# Altium schematic sheet 09 LEDs(2).SchDoc
size A
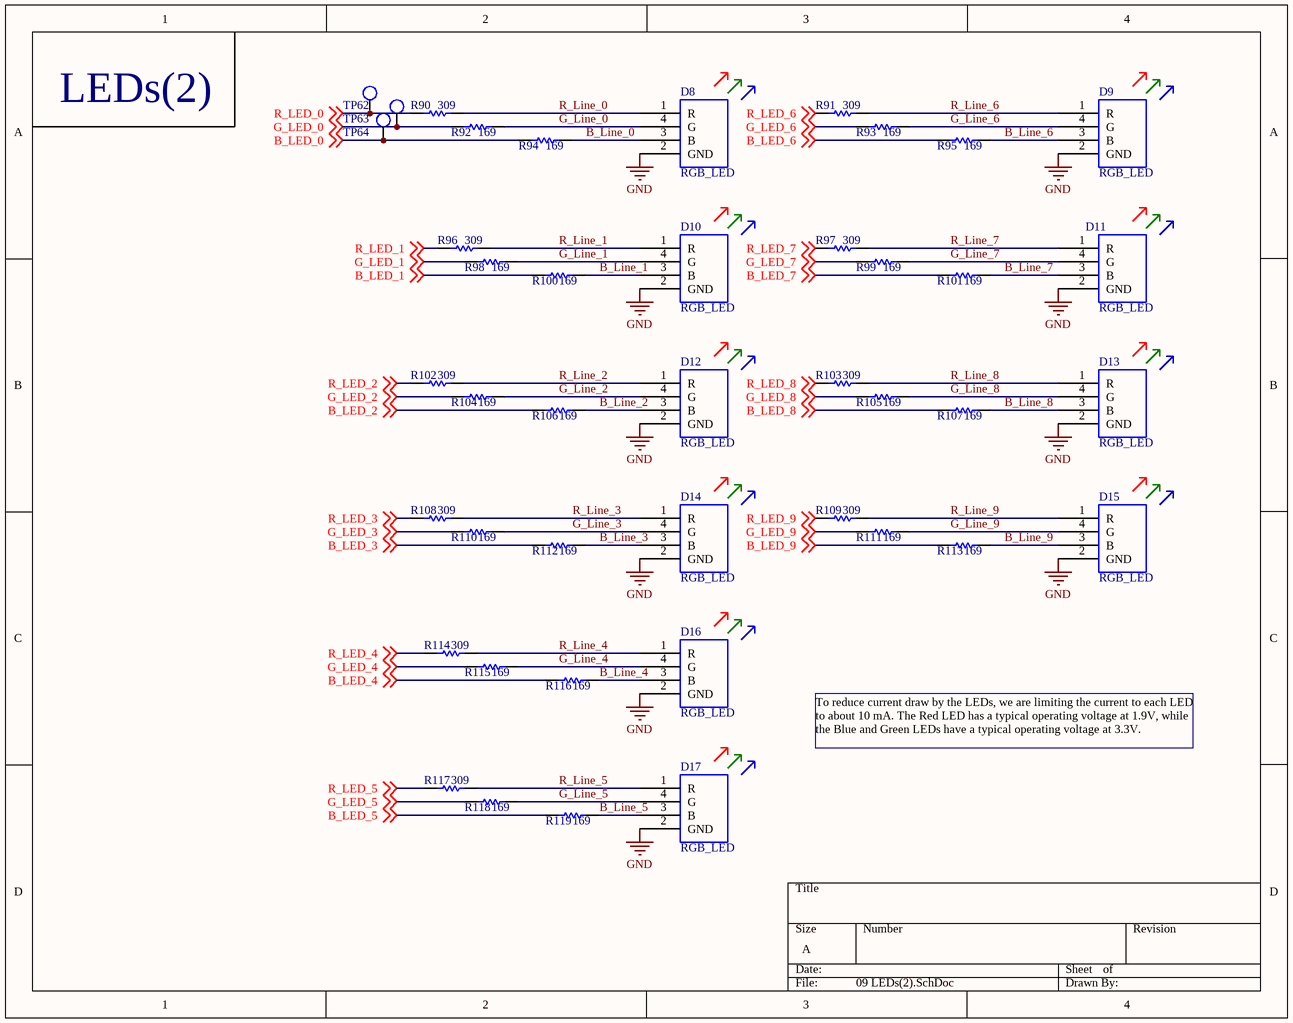
[diagram p0: 09 LEDs(2).SchDoc]

## Parts
D8  RGB_LED  [RGB_LED]
D9  RGB_LED  [RGB_LED]
D10  RGB_LED  [RGB_LED]
D11  RGB_LED  [RGB_LED]
D12  RGB_LED  [RGB_LED]
D13  RGB_LED  [RGB_LED]
D14  RGB_LED  [RGB_LED]
D15  RGB_LED  [RGB_LED]
D16  RGB_LED  [RGB_LED]
D17  RGB_LED  [RGB_LED]
R90  RES_0805_309  [RES0805]  (value not drawn)
R91  RES_0805_309  [RES0805]  (value not drawn)
R92  169 Ohm  [RES0805]  (value not drawn)
R93  169 Ohm  [RES0805]  (value not drawn)
R94  169 Ohm  [RES0805]  (value not drawn)
R95  169 Ohm  [RES0805]  (value not drawn)
R96  RES_0805_309  [RES0805]  (value not drawn)
R97  RES_0805_309  [RES0805]  (value not drawn)
R98  169 Ohm  [RES0805]  (value not drawn)
R99  169 Ohm  [RES0805]  (value not drawn)
R100  169 Ohm  [RES0805]  (value not drawn)
R101  169 Ohm  [RES0805]  (value not drawn)
R102  RES_0805_309  [RES0805]  (value not drawn)
R103  RES_0805_309  [RES0805]  (value not drawn)
R104  169 Ohm  [RES0805]  (value not drawn)
R105  169 Ohm  [RES0805]  (value not drawn)
R106  169 Ohm  [RES0805]  (value not drawn)
R107  169 Ohm  [RES0805]  (value not drawn)
R108  RES_0805_309  [RES0805]  (value not drawn)
R109  RES_0805_309  [RES0805]  (value not drawn)
R110  169 Ohm  [RES0805]  (value not drawn)
R111  169 Ohm  [RES0805]  (value not drawn)
R112  169 Ohm  [RES0805]  (value not drawn)
R113  169 Ohm  [RES0805]  (value not drawn)
R114  RES_0805_309  [RES0805]  (value not drawn)
R115  169 Ohm  [RES0805]  (value not drawn)
R116  169 Ohm  [RES0805]  (value not drawn)
R117  RES_0805_309  [RES0805]  (value not drawn)
R118  169 Ohm  [RES0805]  (value not drawn)
R119  169 Ohm  [RES0805]  (value not drawn)
TP62  TP  [TestPoint_0805]  (value not drawn)
TP63  TP  [TestPoint_0805]  (value not drawn)
TP64  TP  [TestPoint_0805]  (value not drawn)

## Nets
GND: D8.2(GND) D9.2(GND) D10.2(GND) D11.2(GND) D12.2(GND) D13.2(GND) D14.2(GND) D15.2(GND) D16.2(GND) D17.2(GND)
B_LED_0: R94.1 TP64.1 ; off-sheet B_LED_0
B_LED_1: R100.1 ; off-sheet B_LED_1
B_LED_2: R106.1 ; off-sheet B_LED_2
B_LED_3: R112.1 ; off-sheet B_LED_3
B_LED_4: R116.1 ; off-sheet B_LED_4
B_LED_5: R119.1 ; off-sheet B_LED_5
B_LED_6: R95.1 ; off-sheet B_LED_6
B_LED_7: R101.1 ; off-sheet B_LED_7
B_LED_8: R107.1 ; off-sheet B_LED_8
B_LED_9: R113.1 ; off-sheet B_LED_9
B_Line_0: D8.3(B) R94.2
B_Line_1: D10.3(B) R100.2
B_Line_2: D12.3(B) R106.2
B_Line_3: D14.3(B) R112.2
B_Line_4: D16.3(B) R116.2
B_Line_5: D17.3(B) R119.2
B_Line_6: D9.3(B) R95.2
B_Line_7: D11.3(B) R101.2
B_Line_8: D13.3(B) R107.2
B_Line_9: D15.3(B) R113.2
G_LED_0: R92.1 TP63.1 ; off-sheet G_LED_0
G_LED_1: R98.1 ; off-sheet G_LED_1
G_LED_2: R104.1 ; off-sheet G_LED_2
G_LED_3: R110.1 ; off-sheet G_LED_3
G_LED_4: R115.1 ; off-sheet G_LED_4
G_LED_5: R118.1 ; off-sheet G_LED_5
G_LED_6: R93.1 ; off-sheet G_LED_6
G_LED_7: R99.1 ; off-sheet G_LED_7
G_LED_8: R105.1 ; off-sheet G_LED_8
G_LED_9: R111.1 ; off-sheet G_LED_9
G_Line_0: D8.4(G) R92.2
G_Line_1: D10.4(G) R98.2
G_Line_2: D12.4(G) R104.2
G_Line_3: D14.4(G) R110.2
G_Line_4: D16.4(G) R115.2
G_Line_5: D17.4(G) R118.2
G_Line_6: D9.4(G) R93.2
G_Line_7: D11.4(G) R99.2
G_Line_8: D13.4(G) R105.2
G_Line_9: D15.4(G) R111.2
R_LED_0: R90.1 TP62.1 ; off-sheet R_LED_0
R_LED_1: R96.1 ; off-sheet R_LED_1
R_LED_2: R102.1 ; off-sheet R_LED_2
R_LED_3: R108.1 ; off-sheet R_LED_3
R_LED_4: R114.1 ; off-sheet R_LED_4
R_LED_5: R117.1 ; off-sheet R_LED_5
R_LED_6: R91.1 ; off-sheet R_LED_6
R_LED_7: R97.1 ; off-sheet R_LED_7
R_LED_8: R103.1 ; off-sheet R_LED_8
R_LED_9: R109.1 ; off-sheet R_LED_9
R_Line_0: D8.1(R) R90.2
R_Line_1: D10.1(R) R96.2
R_Line_2: D12.1(R) R102.2
R_Line_3: D14.1(R) R108.2
R_Line_4: D16.1(R) R114.2
R_Line_5: D17.1(R) R117.2
R_Line_6: D9.1(R) R91.2
R_Line_7: D11.1(R) R97.2
R_Line_8: D13.1(R) R103.2
R_Line_9: D15.1(R) R109.2

## Notes on the sheet
- LEDs(2)
- To reduce current draw by the LEDs, we are limiting the current to each LED to about 10 mA. The Red LED has a typical operating voltage at 1.9V, while the Blue and Green LEDs have a typical operating voltage at 3.3V.
- (in symbol RES_0805_169) 169
- (in symbol RES_0805_309) 309

## Library data of the parts
D8-D17 = RGB_LED: WP154A4SUREQBFZGC; Manufacturer: Kingbright; Colour: Blue,Green,Red; Luminous Intensity: 900mcd; Lens Style: Dome,Clear; Forward Current: 20mA; Forward Voltage: 3.3V; Viewing Angle: 50°; Dominant Wavelength: 465nm; Supplier 1: Digi-Key; Manufacturer Part Number: WP154A4SUREQBFZGC; Stock 1: 8274; Pricing 1: 1=1.89, 10=1.534, 25=1.18, 100=1.062, 250=0.944, 500=0.8024, 1000=0.6608, 2500=0.6278, 5000=0.6136 (USD); Mount: Through Hole; Case/Package: Radial; Min Operating Temperature: -40°C; Max Operating Temperature: 85°C; Packaging: Bulk; Package Quantity: 500; Test Current: 20mA; Height: 8.6mm; Lead Free: Lead Free; ComponentLink1URL: https://datasheet.ciiva.com/6349/wp154a4sureqbfzgc-6349426.pdf; ComponentLink1Description: https://datasheet.ciiva.com/6349/wp154a4sureqbfzgc-6349426.pdf; ComponentLink2URL: https://datasheet.ciiva.com/13501/wp154a4sureqbfzgc-194997-13501708.pdf; ComponentLink2Description: https://datasheet.ciiva.com/13501/wp154a4sureqbfzgc-194997-13501708.pdf; Supplier Part Number 1: 754-1615-ND
R90 R91 R96 R97 R102 R103 R108 R109 R114 R117 = RES_0805_309: RES SMD 309 OHM 1% 1/8W 0805; Manufacturer: Yageo; Manufacturer Part Number: RC0805FR-07309RL; Resistance: 309R; Temperature Coefficient: 100ppm/°C; Power Rating: 125mW; Voltage Rating: 150V; Supplier 1: Digi-Key; Stock 1: 22039; Pricing 1: 1=0.1, 10=0.022, 100=0.0088, 1000=0.004, 2500=0.0034 (USD); Case/Package: 0805; Contact Plating: Tin,Lead,Matte; Case Code (Imperial): 0805; Case Code (Metric): 2012; Min Operating Temperature: -55°C; Max Operating Temperature: 155°C; Tolerance: 1%; Composition: Thick Film; Packaging: Tape and Reel; Package Quantity: 1; Termination: SMD/SMT; Number of Terminations: 2; Military Standard: Not; Max Power Dissipation: 125mW; Voltage Rating (DC): 150V; Length: 2mm; Height: 0.024inch; Width: 1.25mm; Depth: 1.25mm; Radiation Hardening: No; Lead Free: Lead Free; ComponentLink1URL: https://datasheet.ciiva.com/2457/pyu-r-int-thick-7-2457593.pdf; ComponentLink1Description: https://datasheet.ciiva.com/2457/pyu-r-int-thick-7-2457593.pdf; ComponentLink2URL: https://datasheet.ciiva.com/2457/pyu-r-int-thick-7-2457594.pdf; ComponentLink2Description: https://datasheet.ciiva.com/2457/pyu-r-int-thick-7-2457594.pdf; ComponentLink3URL: https://datasheet.ciiva.com/2457/pyu-r-int-thick-7-2457595.pdf; ComponentLink3Description: https://datasheet.ciiva.com/2457/pyu-r-int-thick-7-2457595.pdf; Supplier Part Number 1: 311-309CRCT-ND
R92-R95 R98-R101 R104-R107 R110-R113 R115 R116 R118 R119 = RES_0805_169: RES SMD 169 OHM 1% 1/8W 0805; Manufacturer: Yageo; Manufacturer Part Number: RC0805FR-07169RL; Resistance: 169R; Temperature Coefficient: 100ppm/°C; Power Rating: 125mW; Voltage Rating: 150V; Supplier 1: Digi-Key; Stock 1: 54311; Pricing 1: 1=0.1, 10=0.022, 100=0.0088, 1000=0.004, 2500=0.0034 (USD); Case/Package: 0805; Contact Plating: Tin,Matte; Case Code (Metric): 2012; Case Code (Imperial): 0805; Min Operating Temperature: -55°C; Max Operating Temperature: 155°C; Tolerance: 1%; Composition: Thick Film; Packaging: Tape and Reel; Package Quantity: 1; Number of Terminations: 2; Termination: SMD/SMT; Military Standard: Not; Max Power Dissipation: 125mW; Voltage Rating (DC): 150V; Length: 2mm; Height: 0.024inch; Width: 0.049inch; Depth: 1.25mm; Radiation Hardening: No; Lead Free: Lead Free; ComponentLink1URL: https://datasheet.ciiva.com/17054/rc0805-17054266.pdf; ComponentLink1Description: https://datasheet.ciiva.com/17054/rc0805-17054266.pdf; ComponentLink2URL: https://datasheet.ciiva.com/2509/pyu-r-int-thick-7-2509468.pdf; ComponentLink2Description: https://datasheet.ciiva.com/2509/pyu-r-int-thick-7-2509468.pdf; ComponentLink3URL: https://datasheet.ciiva.com/2509/pyu-r-int-thick-7-2509469.pdf; ComponentLink3Description: https://datasheet.ciiva.com/2509/pyu-r-int-thick-7-2509469.pdf; ComponentLink4URL: https://datasheet.ciiva.com/2509/pyu-r-int-thick-7-2509470.pdf; ComponentLink4Description: https://datasheet.ciiva.com/2509/pyu-r-int-thick-7-2509470.pdf; Supplier Part Number 1: 311-169CRCT-ND
TP62-TP64 = TP: Testpoint_0805; Manufacturer: TE Connectivity; Manufacturer Part Number: 1625854-2; Resistance: 0mR; Supplier 1: Digi-Key; Stock 1: 27299; Pricing 1: 1=0.21, 10=0.2, 25=0.1708, 50=0.1496, 100=0.1389, 250=0.1229, 500=0.1175, 1000=0.0962 (USD); Case/Package: 0805; Colour: Natural; Min Operating Temperature: -55°C; Max Operating Temperature: 125°C; Packaging: Tape and Reel; Package Quantity: 2000; Military Standard: Not; Length: 2mm; Depth: 1.2mm; Radiation Hardening: No; Lead Free: Lead Free; ComponentLink1URL: https://datasheet.ciiva.com/6439/eng-ds-1773266-a-6439169.pdf; ComponentLink1Description: https://datasheet.ciiva.com/6439/eng-ds-1773266-a-6439169.pdf; ComponentLink2URL: https://datasheet.ciiva.com/30238/1773266-a-30238966.pdf; ComponentLink2Description: https://datasheet.ciiva.com/30238/1773266-a-30238966.pdf; ComponentLink3URL: https://datasheet.ciiva.com/8914/eng-ds-1773266-a-8914649.pdf; ComponentLink3Description: https://datasheet.ciiva.com/8914/eng-ds-1773266-a-8914649.pdf; Supplier Part Number 1: A106144CT-ND; Mount: Surface Mount